# Altium schematic sheet ATM90E2x-DB.SchDoc: Atmel Single Phase Energy Metering Demo Board
size A4; DrawnBy: Felix Yao; Organization: Smart Energy; Revision: 1.0; SheetNumber: 1; SheetTotal: 1; PageSetup: Record=PageOptions|CenterHorizontal=True|CenterVertical=True|PrintScale=0.97|XCorrection=1.00|YCorrection=1.00|PrintKind=1|BorderSize=5000000|LeftOffset=0|BottomOffset=0|Orientation=2|PaperLength=2969|PaperWidth=2100|Scale=100|PaperSource=7|PrintQuality=600|MediaType=1|DitherType=10|PaperKind=A4 (210 x 297 mm)|PrintScaleMode=1
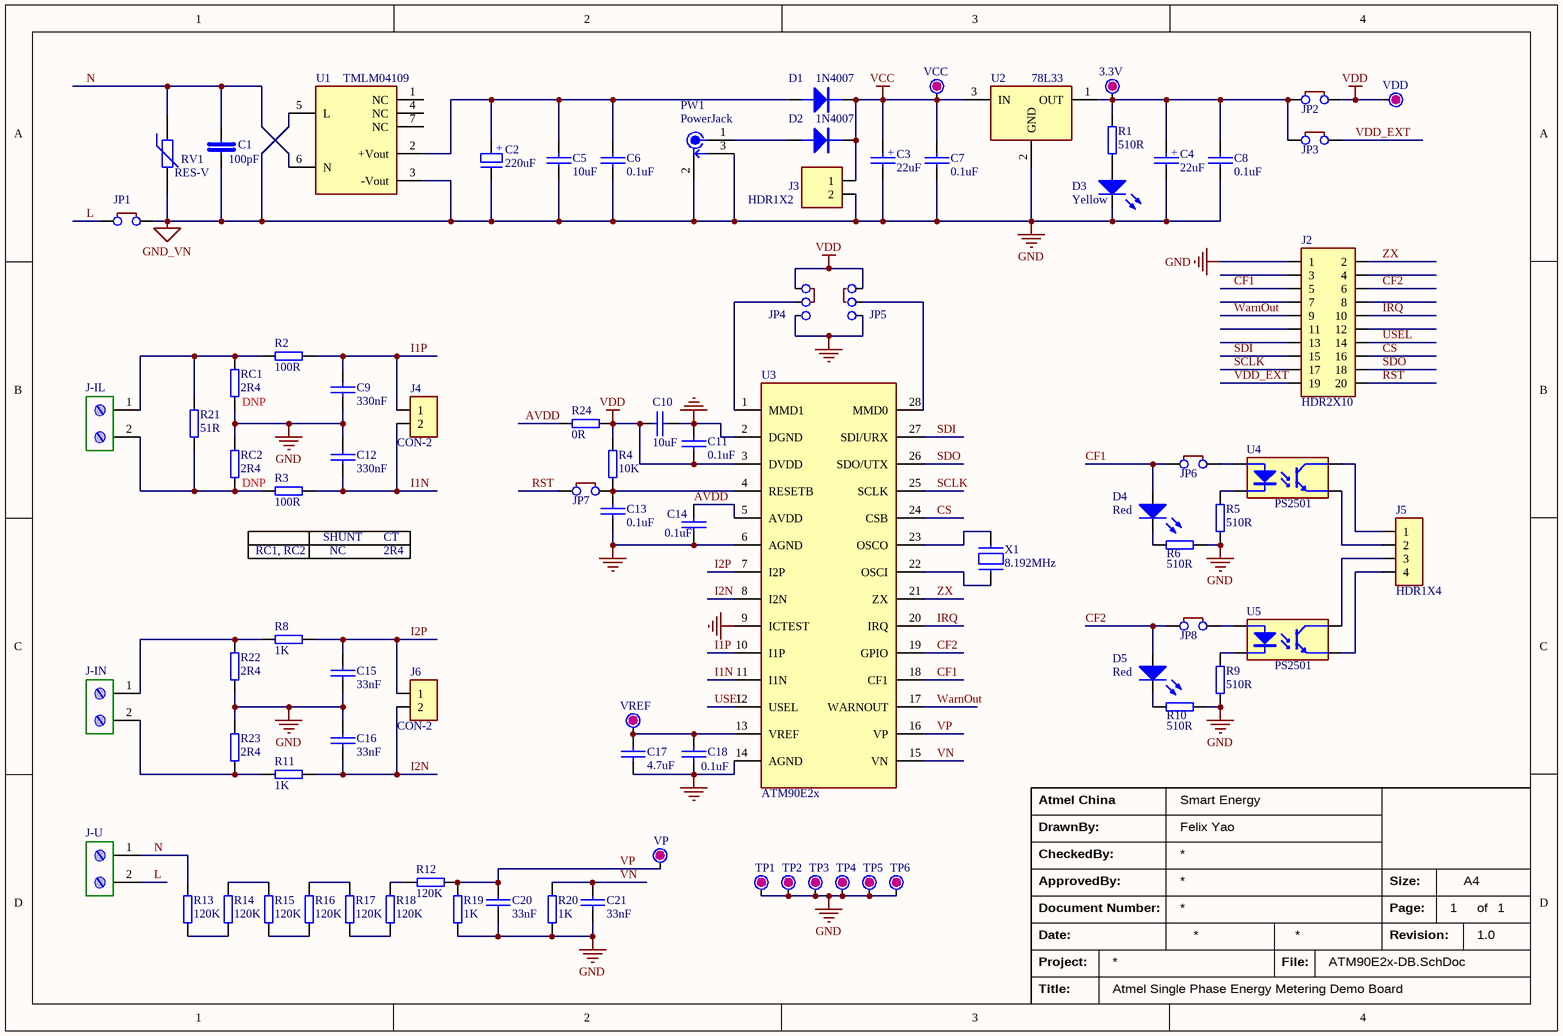
[diagram p0: ATM90E2x-DB.SchDoc]

## Parts
3.3V  TEST-POINT  [TP]  (value not drawn)
C1  100pF  [C_FILM_600]
C2  220uF  [C_ALUM_MIX_10x10]
C3  22uF  [C_TANT_B3528]
C4  22uF  [C_TANT_B3528]
C5  10uF  [C0805]
C6  0.1uF  [C0805]
C7  0.1uF  [C0805]
C8  0.1uF  [C0805]
C9  330nF  [C0805]
C10  10uF  [C0805]
C11  0.1uF  [C0603]
C12  330nF  [C0805]
C13  0.1uF  [C0603]
C14  0.1uF  [C0603]
C15  33nF  [C0805]
C16  33nF  [C0805]
C17  4.7uF  [C0805]
C18  0.1uF  [C0603]
C20  33nF  [C0805]
C21  33nF  [C0805]
D1  1N4007  [SMA DO-214AC]
D2  1N4007  [SMA DO-214AC]
D3  Yellow  [LED-0805Y]
D4  Red  [LED-0805R]
D5  Red  [LED-0805R]
J2  HDR2X10  [HDR2X10]
J3  HDR1X2  [HDR1X2]
J4  CON-2  [HDR1X2(uper)]
J5  HDR1X4  [HDR1X4]
J6  CON-2  [HDR1X2(uper)]
J-IL  (no value)  [TE-1776119-2]
J-IN  (no value)  [TE-1776119-2]
J-U  (no value)  [TE-282843-2]
JP1  JMP  [JMP-SMD]  (value not drawn)
JP2  JMP  [JMP]  (value not drawn)
JP3  JMP  [JMP]  (value not drawn)
JP4  JMP3  [JMP3]  (value not drawn)
JP5  JMP3  [JMP3]  (value not drawn)
JP6  JMP  [JMP]  (value not drawn)
JP7  JMP  [JMP]  (value not drawn)
JP8  JMP  [JMP]  (value not drawn)
PW1  PowerJack  [PowerJacket2.5]
R1  510R  [R0805]
R2  100R  [R0805]
R3  100R  [R0805]
R4  10K  [R0603]
R5  510R  [R0805]
R6  510R  [R0805]
R8  1K  [R0805]
R9  510R  [R0805]
R10  510R  [R0805]
R11  1K  [R0805]
R12  120K  [R1206]
R13  120K  [R1206]
R14  120K  [R1206]
R15  120K  [R1206]
R16  120K  [R1206]
R17  120K  [R1206]
R18  120K  [R1206]
R19  1K  [R0805]
R20  1K  [R0805]
R21  51R  [R0805]
R22  2R4  [R0805]
R23  2R4  [R0805]
R24  0R  [R0603]
RC1  2R4  [R0805]
RC2  2R4  [R0805]
RV1  RES-V  [VDRS10P510BSE]
TP1  GND  [TP]  (value not drawn)
TP2  GND  [TP]  (value not drawn)
TP3  GND  [TP]  (value not drawn)
TP4  GND  [TP]  (value not drawn)
TP5  GND  [TP-SMD]  (value not drawn)
TP6  GND  [TP-SMD]  (value not drawn)
U1  TMLM04109  [TMLM04112]
U2  78L33  [SOT-89]
U3  ATM90E2x  [SSOP-28]
U4  PS2501  [PS2501L-1]
U5  PS2501  [PS2501L-1]
VCC  TEST-POINT  [TP]  (value not drawn)
VDD  TEST-POINT  [TP]  (value not drawn)
VP  TEST-POINT  [TP]  (value not drawn)
VREF  TEST-POINT  [TP]  (value not drawn)
X1  8.192MHz  [XTAL-MIX-49]

## Nets
GND: C1.2 C2.2 C3.2 C4.2 C5.1 C6.1 C7.1 C8.1 C9.1 C10.2 C11.2 C12.2 C13.1 C14.1 C15.1 C16.2 C17.1 C18.1 C20.1 C21.1 D3.K J2.1 J3.2 JP1.2 JP4.3 JP5.3 PW1.2 PW1.3 R5.1 R6.1 R9.1 R10.1 R19.1 R20.1 R22.1 R23.2 RC1.1 RC2.2 RV1.2 TP1.1 TP2.1 TP3.1 TP4.1 TP5.1 TP6.1 U1.3(-Vout) U1.5(L) U2.2(GND) U3.2(DGND) U3.6(AGND) U3.9(ICTEST) U3.14(AGND)  [also labelled GND_VN]
VCC: C3.1 C7.2 D1.K D2.K J3.1 U2.3(IN) VCC.1
VDD: C10.1 C11.1 JP2.2 JP4.1 JP5.1 R4.2 R24.2 U3.3(DVDD) VDD.1
AVDD: C14.2 R24.1 U3.5(AVDD)
CF1: D4.A J2.5 JP6.1 U3.18(CF1)
CF2: D5.A J2.6 JP8.1 U3.19(GPIO)
CS: J2.16 U3.24(CSB)
I1N: C12.1 J4.2 R3.1 U3.11(I1N)
I1P: C9.2 J4.1 R2.1 U3.10(I1P)
I2N: C16.1 J6.2 R11.1 U3.8(I2N)
I2P: C15.2 J6.1 R8.1 U3.7(I2P)
IRQ: J2.10 U3.20(IRQ)
L: J-U.2 JP1.1
N: C1.1 J-U.1 R13.1 RV1.1 U1.6(N)
RST: J2.20 JP7.1
SCLK: J2.17 U3.25(SCLK)
SDI: J2.15 U3.27(SDI/URX)
SDO: J2.18 U3.26(SDO/UTX)
USEL: J2.14 U3.12(USEL)
VDD_EXT: J2.19 JP3.2
VN: C21.2 R20.2 U3.15(VN)
VP: C20.2 R12.2 R19.2 U3.16(VP) VP.1
WarnOut: J2.9 U3.17(WARNOUT)
ZX: J2.2 U3.21(ZX)
Net3.3V_1: 3.3V.1 C4.1 C8.2 JP2.1 JP3.1 R1.2 U2.1(OUT)
NetC2_1: C2.1 C5.2 C6.2 D1.A U1.2(+Vout)
NetC13_2: C13.2 JP7.2 R4.1 U3.4(RESETB)
NetC17_2: C17.2 C18.2 U3.13(VREF) VREF.1
NetD2_A: D2.A PW1.1
NetD3_A: D3.A R1.1
NetD4_K: D4.K R6.2
NetD5_K: D5.K R10.2
NetJ5_1: J5.1 U4.4(C)
NetJ5_2: J5.2 U4.3(E)
NetJ5_3: J5.3 U5.4(C)
NetJ5_4: J5.4 U5.3(E)
NetJ-IL_1: J-IL.1 R2.2 R21.2 RC1.2
NetJ-IL_2: J-IL.2 R3.2 R21.1 RC2.1
NetJ-IN_1: J-IN.1 R8.2 R22.2
NetJ-IN_2: J-IN.2 R11.2 R23.1
NetJP4_2: JP4.2 U3.1(MMD1)
NetJP5_2: JP5.2 U3.28(MMD0)
NetJP6_2: JP6.2 U4.1(A)
NetJP8_2: JP8.2 U5.1(A)
NetR5_2: R5.2 U4.2(K)
NetR9_2: R9.2 U5.2(K)
NetR12_1: R12.1 R18.1
NetR13_2: R13.2 R14.2
NetR14_1: R14.1 R15.1
NetR15_2: R15.2 R16.2
NetR16_1: R16.1 R17.1
NetR17_2: R17.2 R18.2
NetU3_22: U3.22(OSCI) X1.2
NetU3_23: U3.23(OSCO) X1.1

Not connected (* = marked no-connect by the designer): J2 3 4 7 8 11 12 13; U1 1(NC) 4(NC) 7(NC)

## Notes on the sheet
- (near RC1) DNP
- (near RC2) DNP
- RC1, RC2
- SHUNT
- NC
- CT
- 2R4
- Atmel China
- DrawnBy:
- Document Number:
- CheckedBy:
- ApprovedBy:
- Page:
- Size:
- A4
- of
- Project:
- Date:
- File:
- Revision:
- Title:
- (in symbol CAP-ALUM) +
- (in symbol CAP-TANT) +

## Library data of the parts
C1 = CAP-FILM
C2 = CAP-ALUM
C3 C4 = CAP-TANT
C5-C18 C20 C21 = CAP
D1 D2 = DIODE
D3-D5 = LED
J-IL J-IN J-U = Terminal-Screw-2
R1-R6 R8-R24 RC1 RC2 = RES
TP1-TP6 = TEST-POINT
U1 = TMLM04112
U2 = 78LXX
U3 = ATM90E25
U4 U5 = NEC2501
X1 = XTAL-T